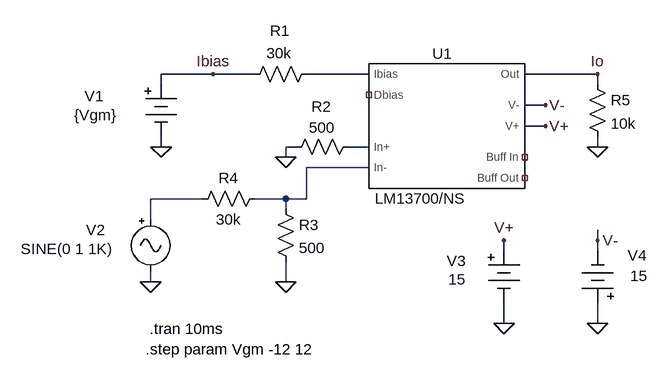
[diagram p0: schematic LM13700 sch.asc]
LM13700 sch.asc, the LTspice schematic file:
Version 4
SHEET 1 880 680
WIRE -176 112 -256 112
WIRE -112 112 -176 112
WIRE 64 112 -32 112
WIRE 416 112 304 112
WIRE -256 128 -256 112
WIRE 416 128 416 112
WIRE 336 160 304 160
WIRE 336 192 304 192
WIRE -256 224 -256 208
WIRE -48 224 -64 224
WIRE 64 224 32 224
WIRE 416 224 416 208
WIRE -64 240 -64 224
WIRE 64 256 -32 256
WIRE -192 304 -272 304
WIRE -64 304 -112 304
WIRE -32 304 -32 256
WIRE -32 304 -64 304
WIRE -64 320 -64 304
WIRE -272 336 -272 304
WIRE 416 368 416 352
WIRE 272 384 272 368
WIRE 416 384 416 368
WIRE -272 432 -272 416
WIRE -64 432 -64 400
WIRE 272 496 272 464
WIRE 416 496 416 464
FLAG -256 224 0
FLAG -176 112 Ibias
FLAG -64 240 0
FLAG -272 432 0
FLAG -64 432 0
FLAG 416 224 0
FLAG 416 112 Io
FLAG 272 496 0
FLAG 416 496 0
FLAG 272 368 V+
FLAG 416 368 V-
FLAG 336 192 V+
FLAG 336 160 V-
SYMBOL AutoGenerated\\LM13700_NS 96 176 R0
SYMATTR InstName U1
SYMBOL res -16 96 R90
WINDOW 0 -35 57 VBottom 2
WINDOW 3 -32 58 VTop 2
SYMATTR InstName R1
SYMATTR Value 30k
SYMBOL Misc\\battery -256 112 R0
WINDOW 0 -118 34 Left 2
WINDOW 3 -134 63 Left 2
WINDOW 123 0 0 Left 0
WINDOW 39 0 0 Left 0
SYMATTR InstName V1
SYMATTR Value {Vgm}
SYMBOL res 48 208 R90
WINDOW 0 -30 57 VBottom 2
WINDOW 3 -29 56 VTop 2
SYMATTR InstName R2
SYMATTR Value 500
SYMBOL res -80 304 R0
SYMATTR InstName R3
SYMATTR Value 500
SYMBOL res -96 288 R90
WINDOW 0 0 56 VBottom 2
WINDOW 3 32 56 VTop 2
SYMATTR InstName R4
SYMATTR Value 30k
SYMBOL Misc\\signal -272 320 R0
WINDOW 0 -99 32 Left 2
WINDOW 3 -200 61 Left 2
SYMATTR InstName V2
SYMBOL res 400 112 R0
SYMATTR InstName R5
SYMATTR Value 10k
SYMBOL Misc\\battery 272 368 R0
WINDOW 0 -88 32 Left 2
WINDOW 3 -86 60 Left 2
WINDOW 123 0 0 Left 0
WINDOW 39 0 0 Left 0
SYMATTR InstName V3
SYMATTR Value 15
SYMBOL Misc\\battery 416 480 R180
WINDOW 0 -76 89 Left 2
WINDOW 3 -77 57 Left 2
WINDOW 123 0 0 Left 0
WINDOW 39 0 0 Left 0
SYMATTR InstName V4
SYMATTR Value 15
TEXT -274 504 Left 2 !.tran 10ms
TEXT -280 536 Left 2 !.step param Vgm -12 12

The netlist it stands for:
* LM13700 sch.asc
XU1 N001 NC_01 N002 N003 Io V- NC_02 NC_03 V+ LM13700/NS  ; pins Ibias Dbias In+ In- Out V- Buff_In Buff_Out V+
R1 N001 Ibias 30k
V1 Ibias 0 {Vgm}
R2 N002 0 500
R3 N003 0 500
R4 N003 N004 30k
V2 N004 0 SINE(0 1 1K)
R5 Io 0 10k
V3 V+ 0 15
V4 0 V- 15
.tran 10ms
.step param Vgm -12 12
.lib C:\Users\Euge\Documents\UTN\Ayudantías\TC2\LTSpice\OTA LM13700\LM13700.MOD
.backanno
.end